# EasyEDA schematic SCH_opl3lpt_2022-04-21.json

## Sheets
1 MAIN: TITLE: Sheet_1; REV: 1.0; Date: 2022-03-24; Sheet: 1/1; Drawn By: Denjhang; Company: Your Company
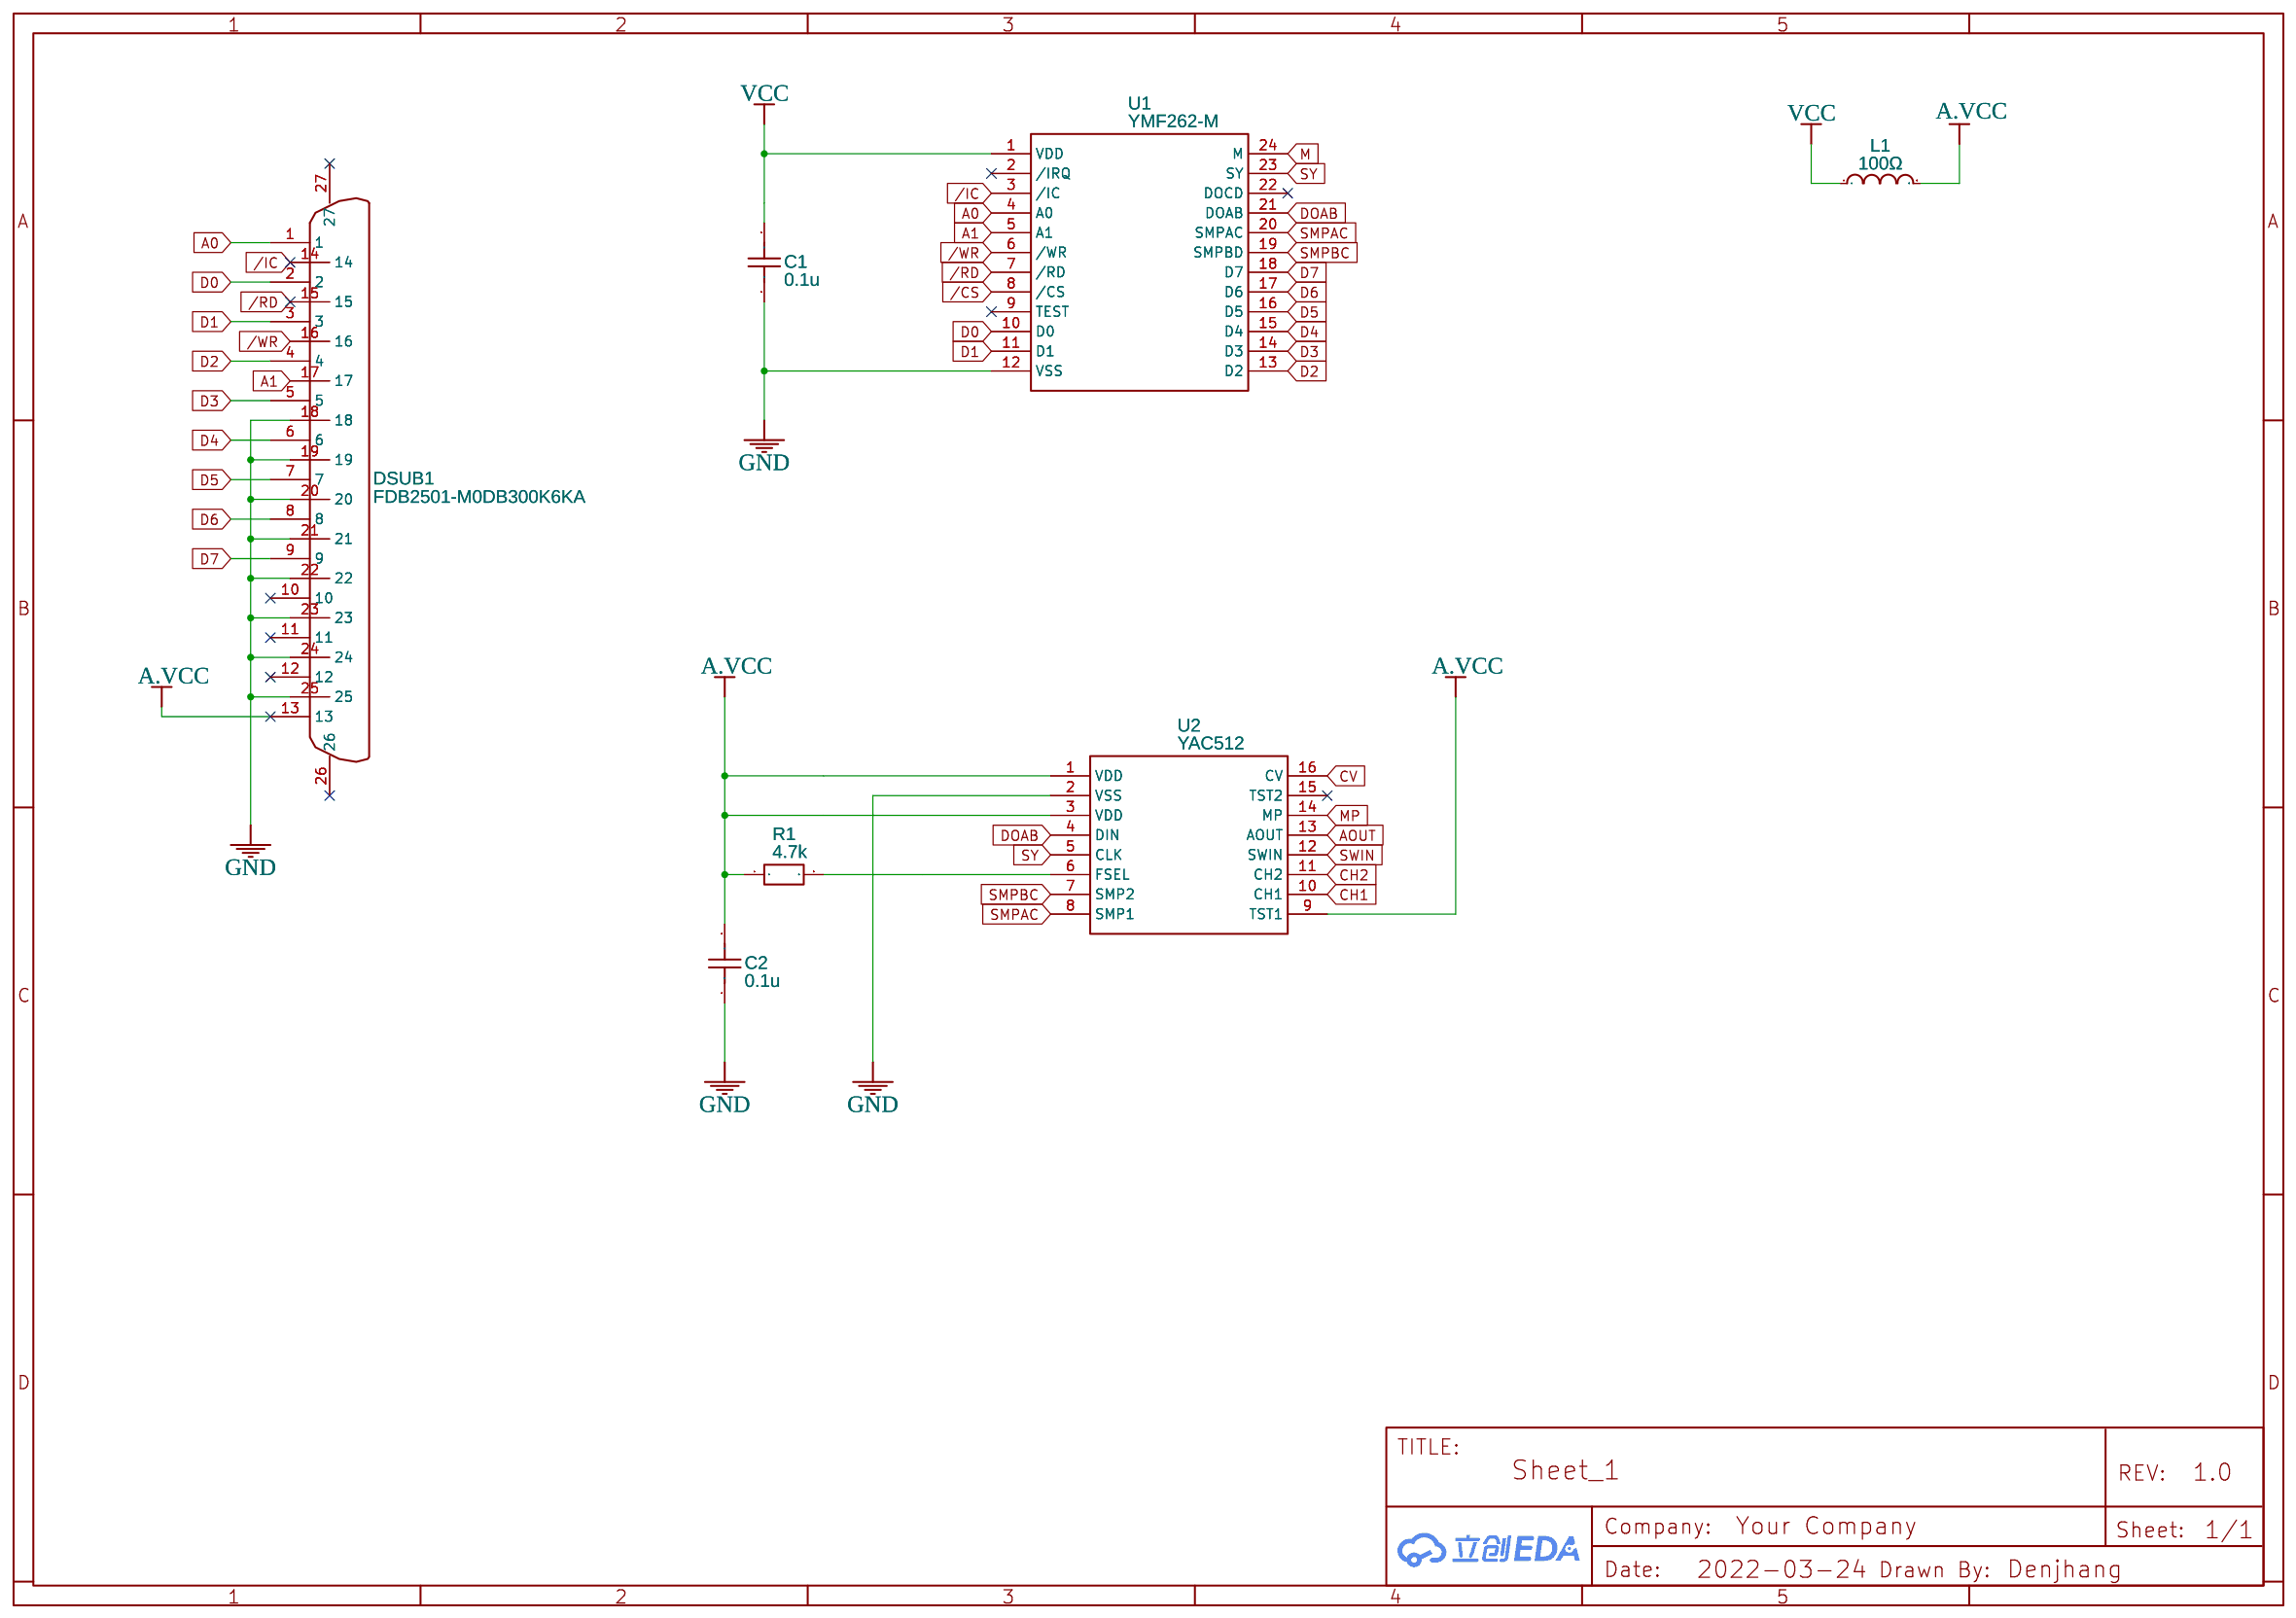
[diagram p0: MAIN]
2 AMP1
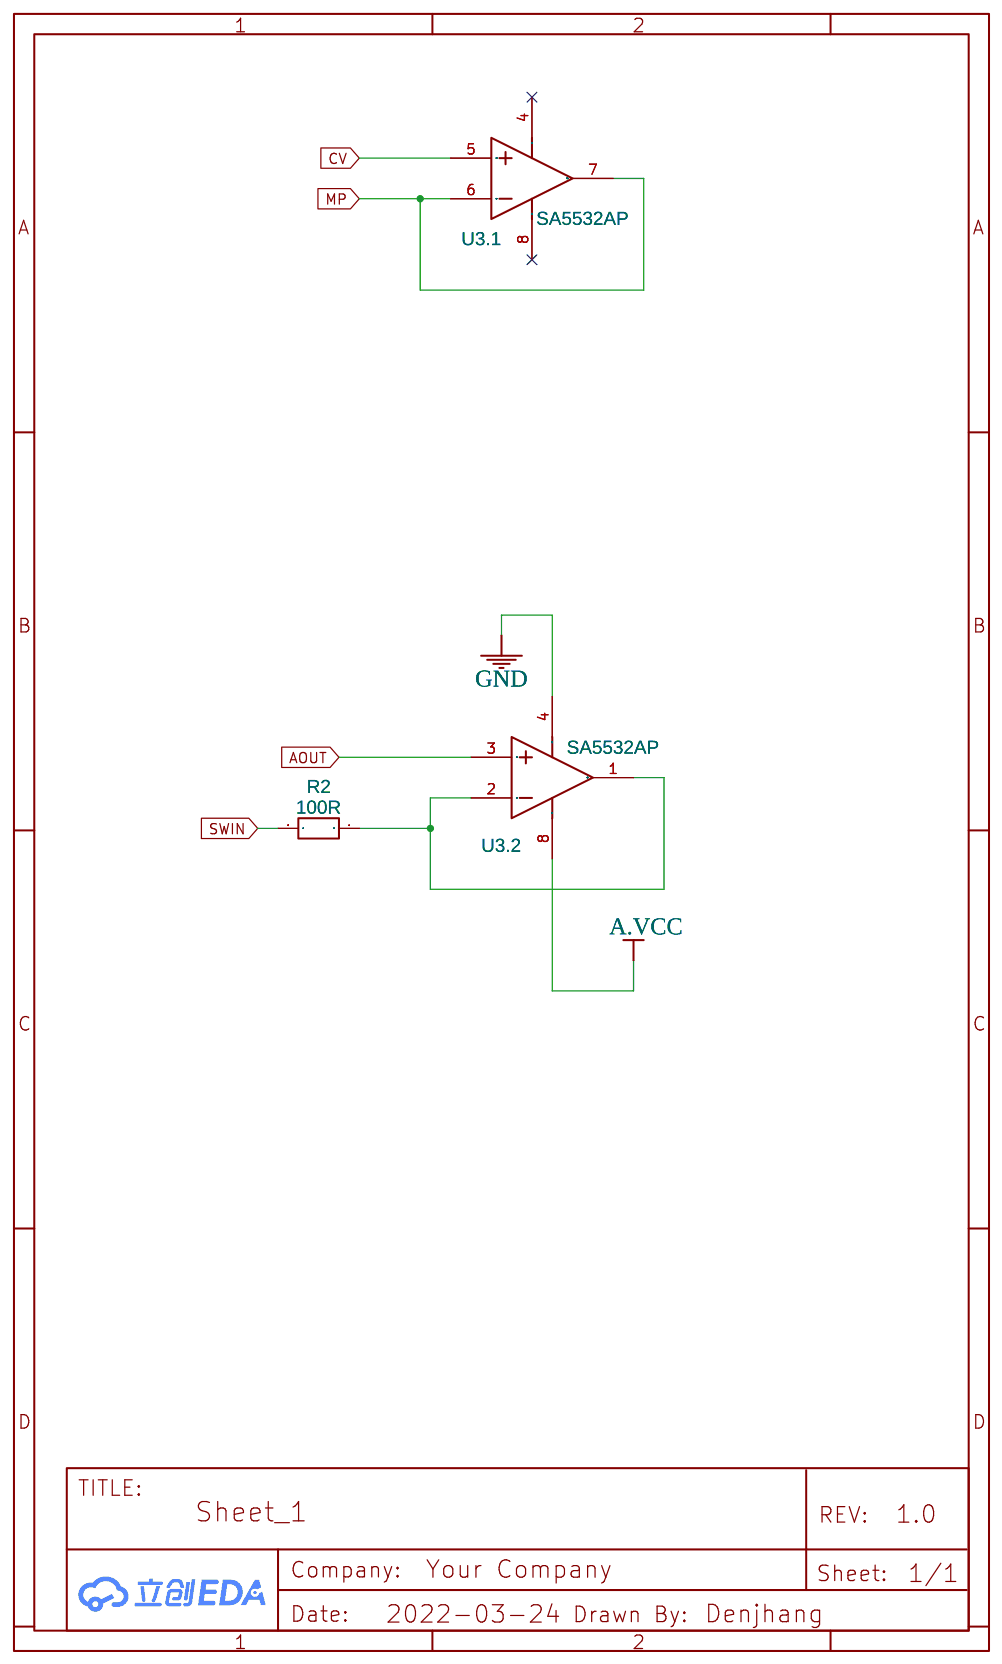
[diagram p1: AMP1]
3 AMP2
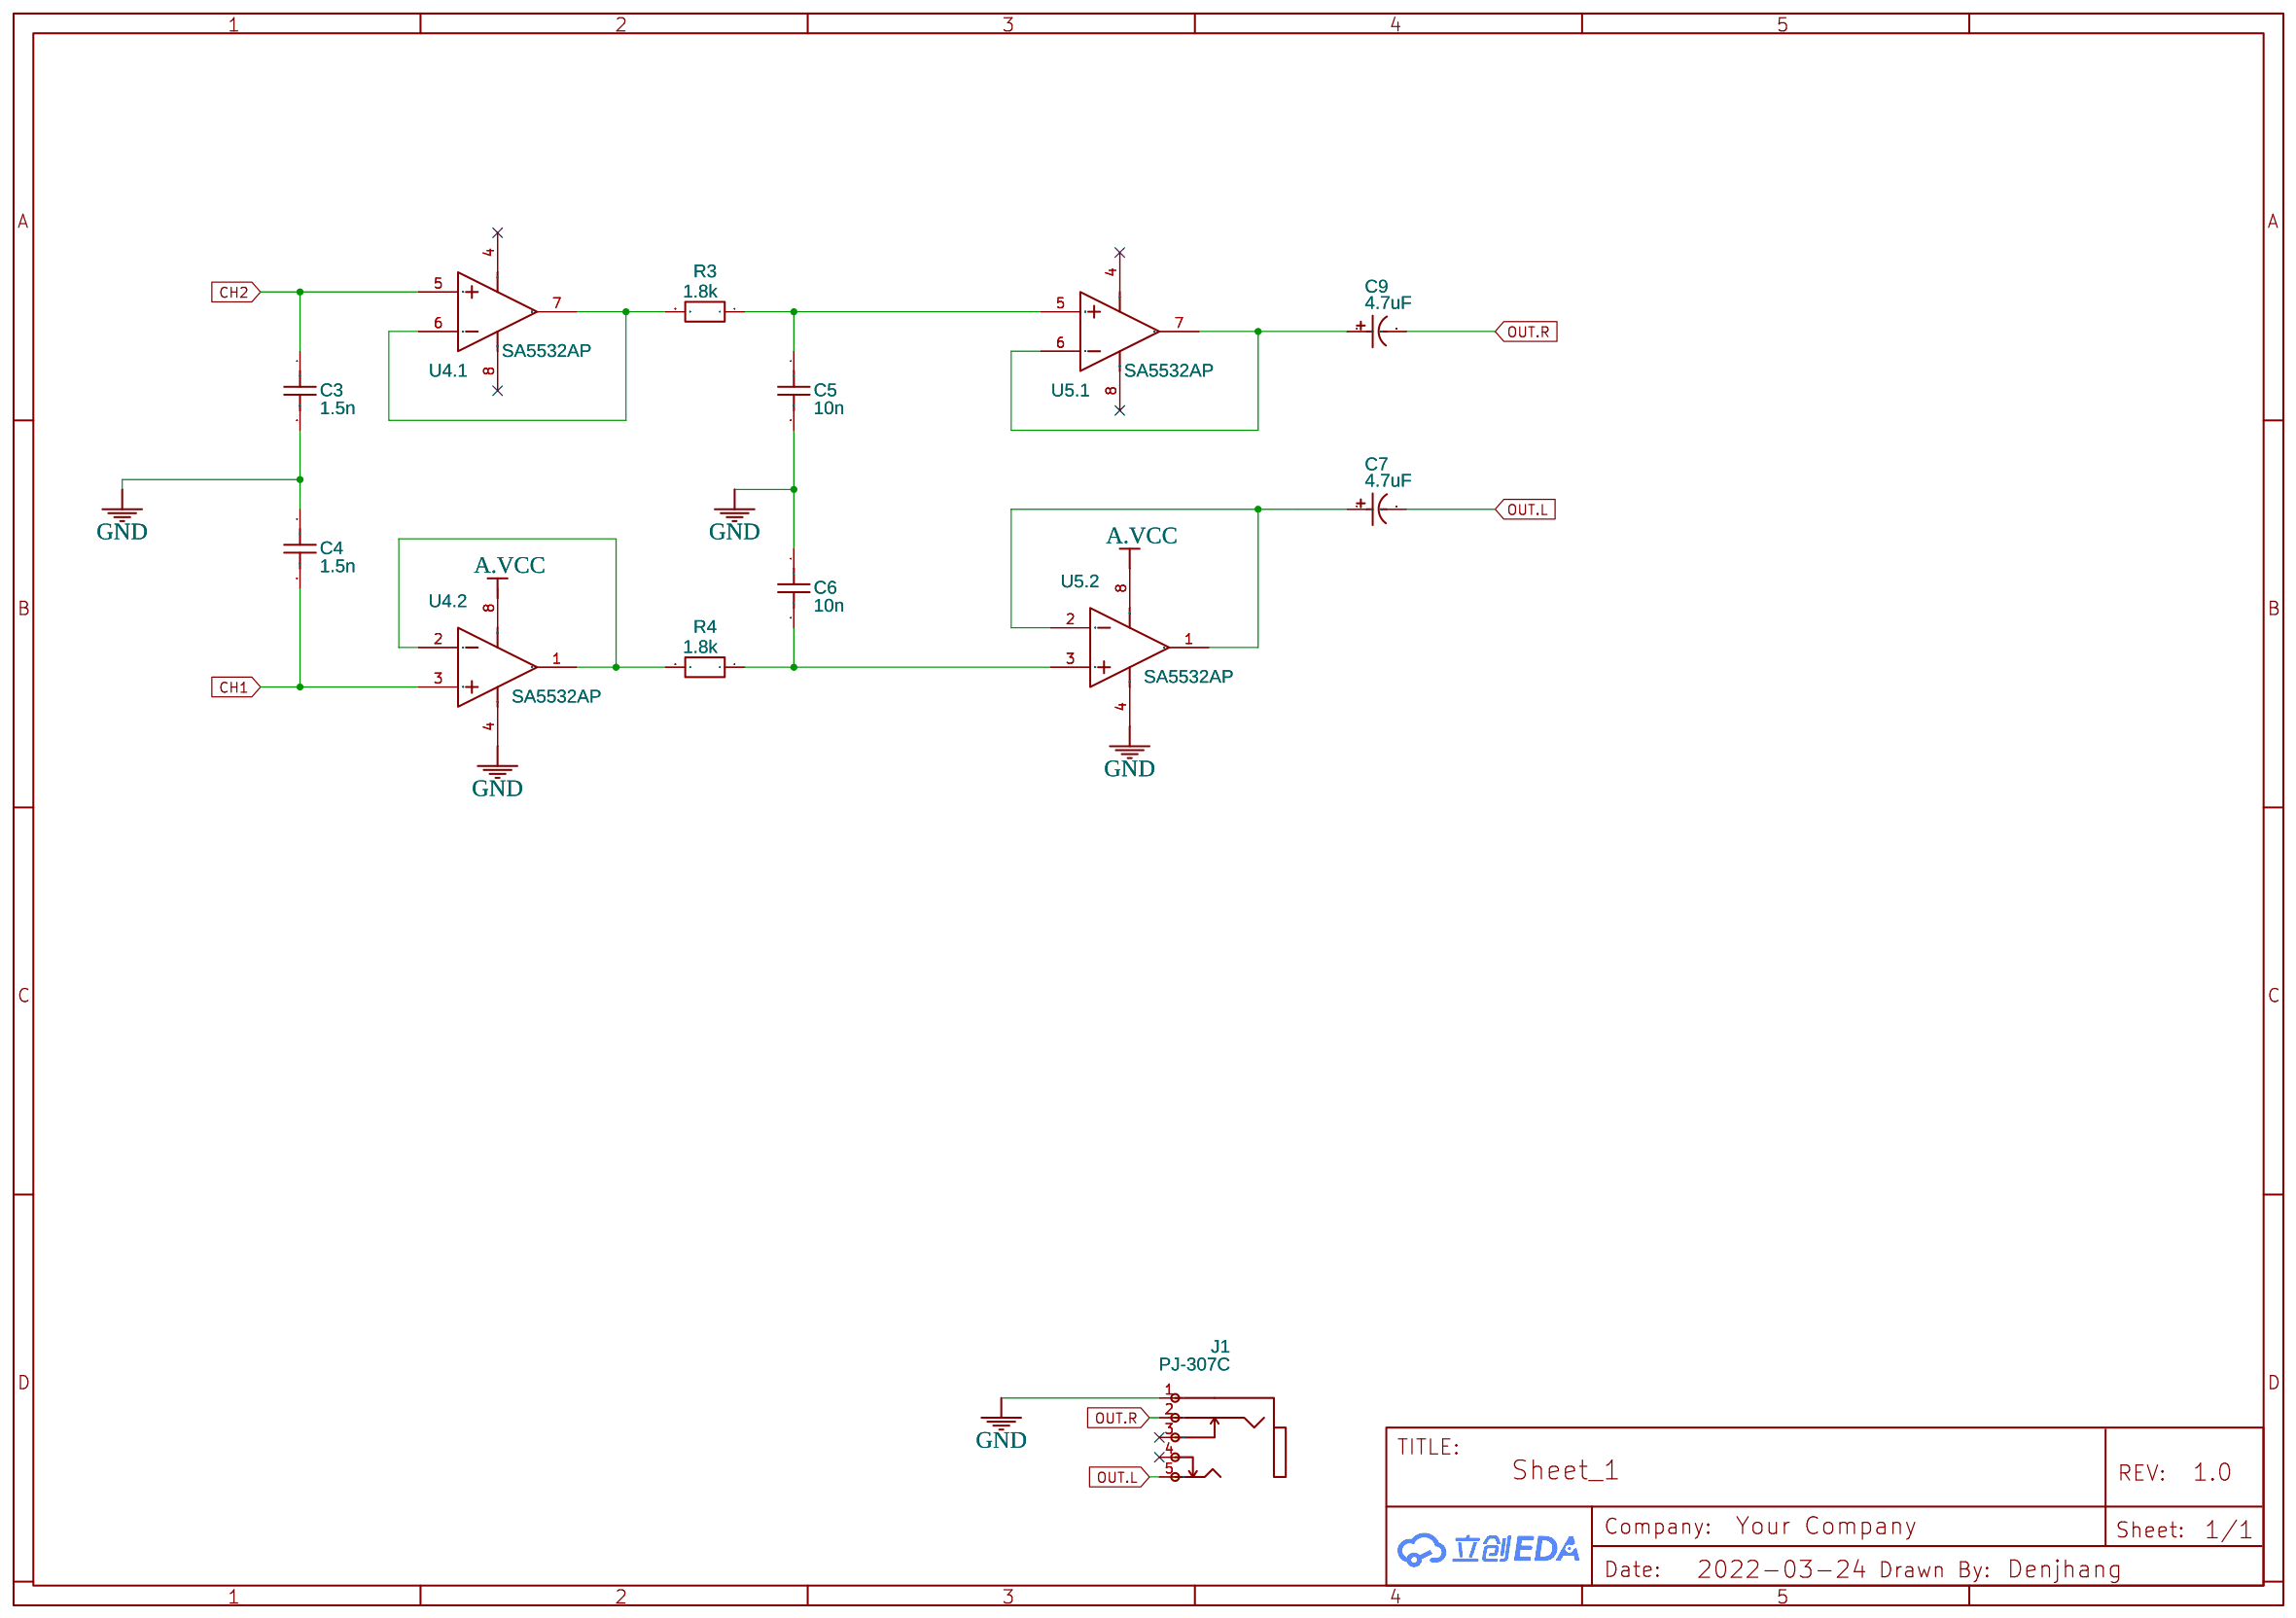
[diagram p2: AMP2]
4 MISC
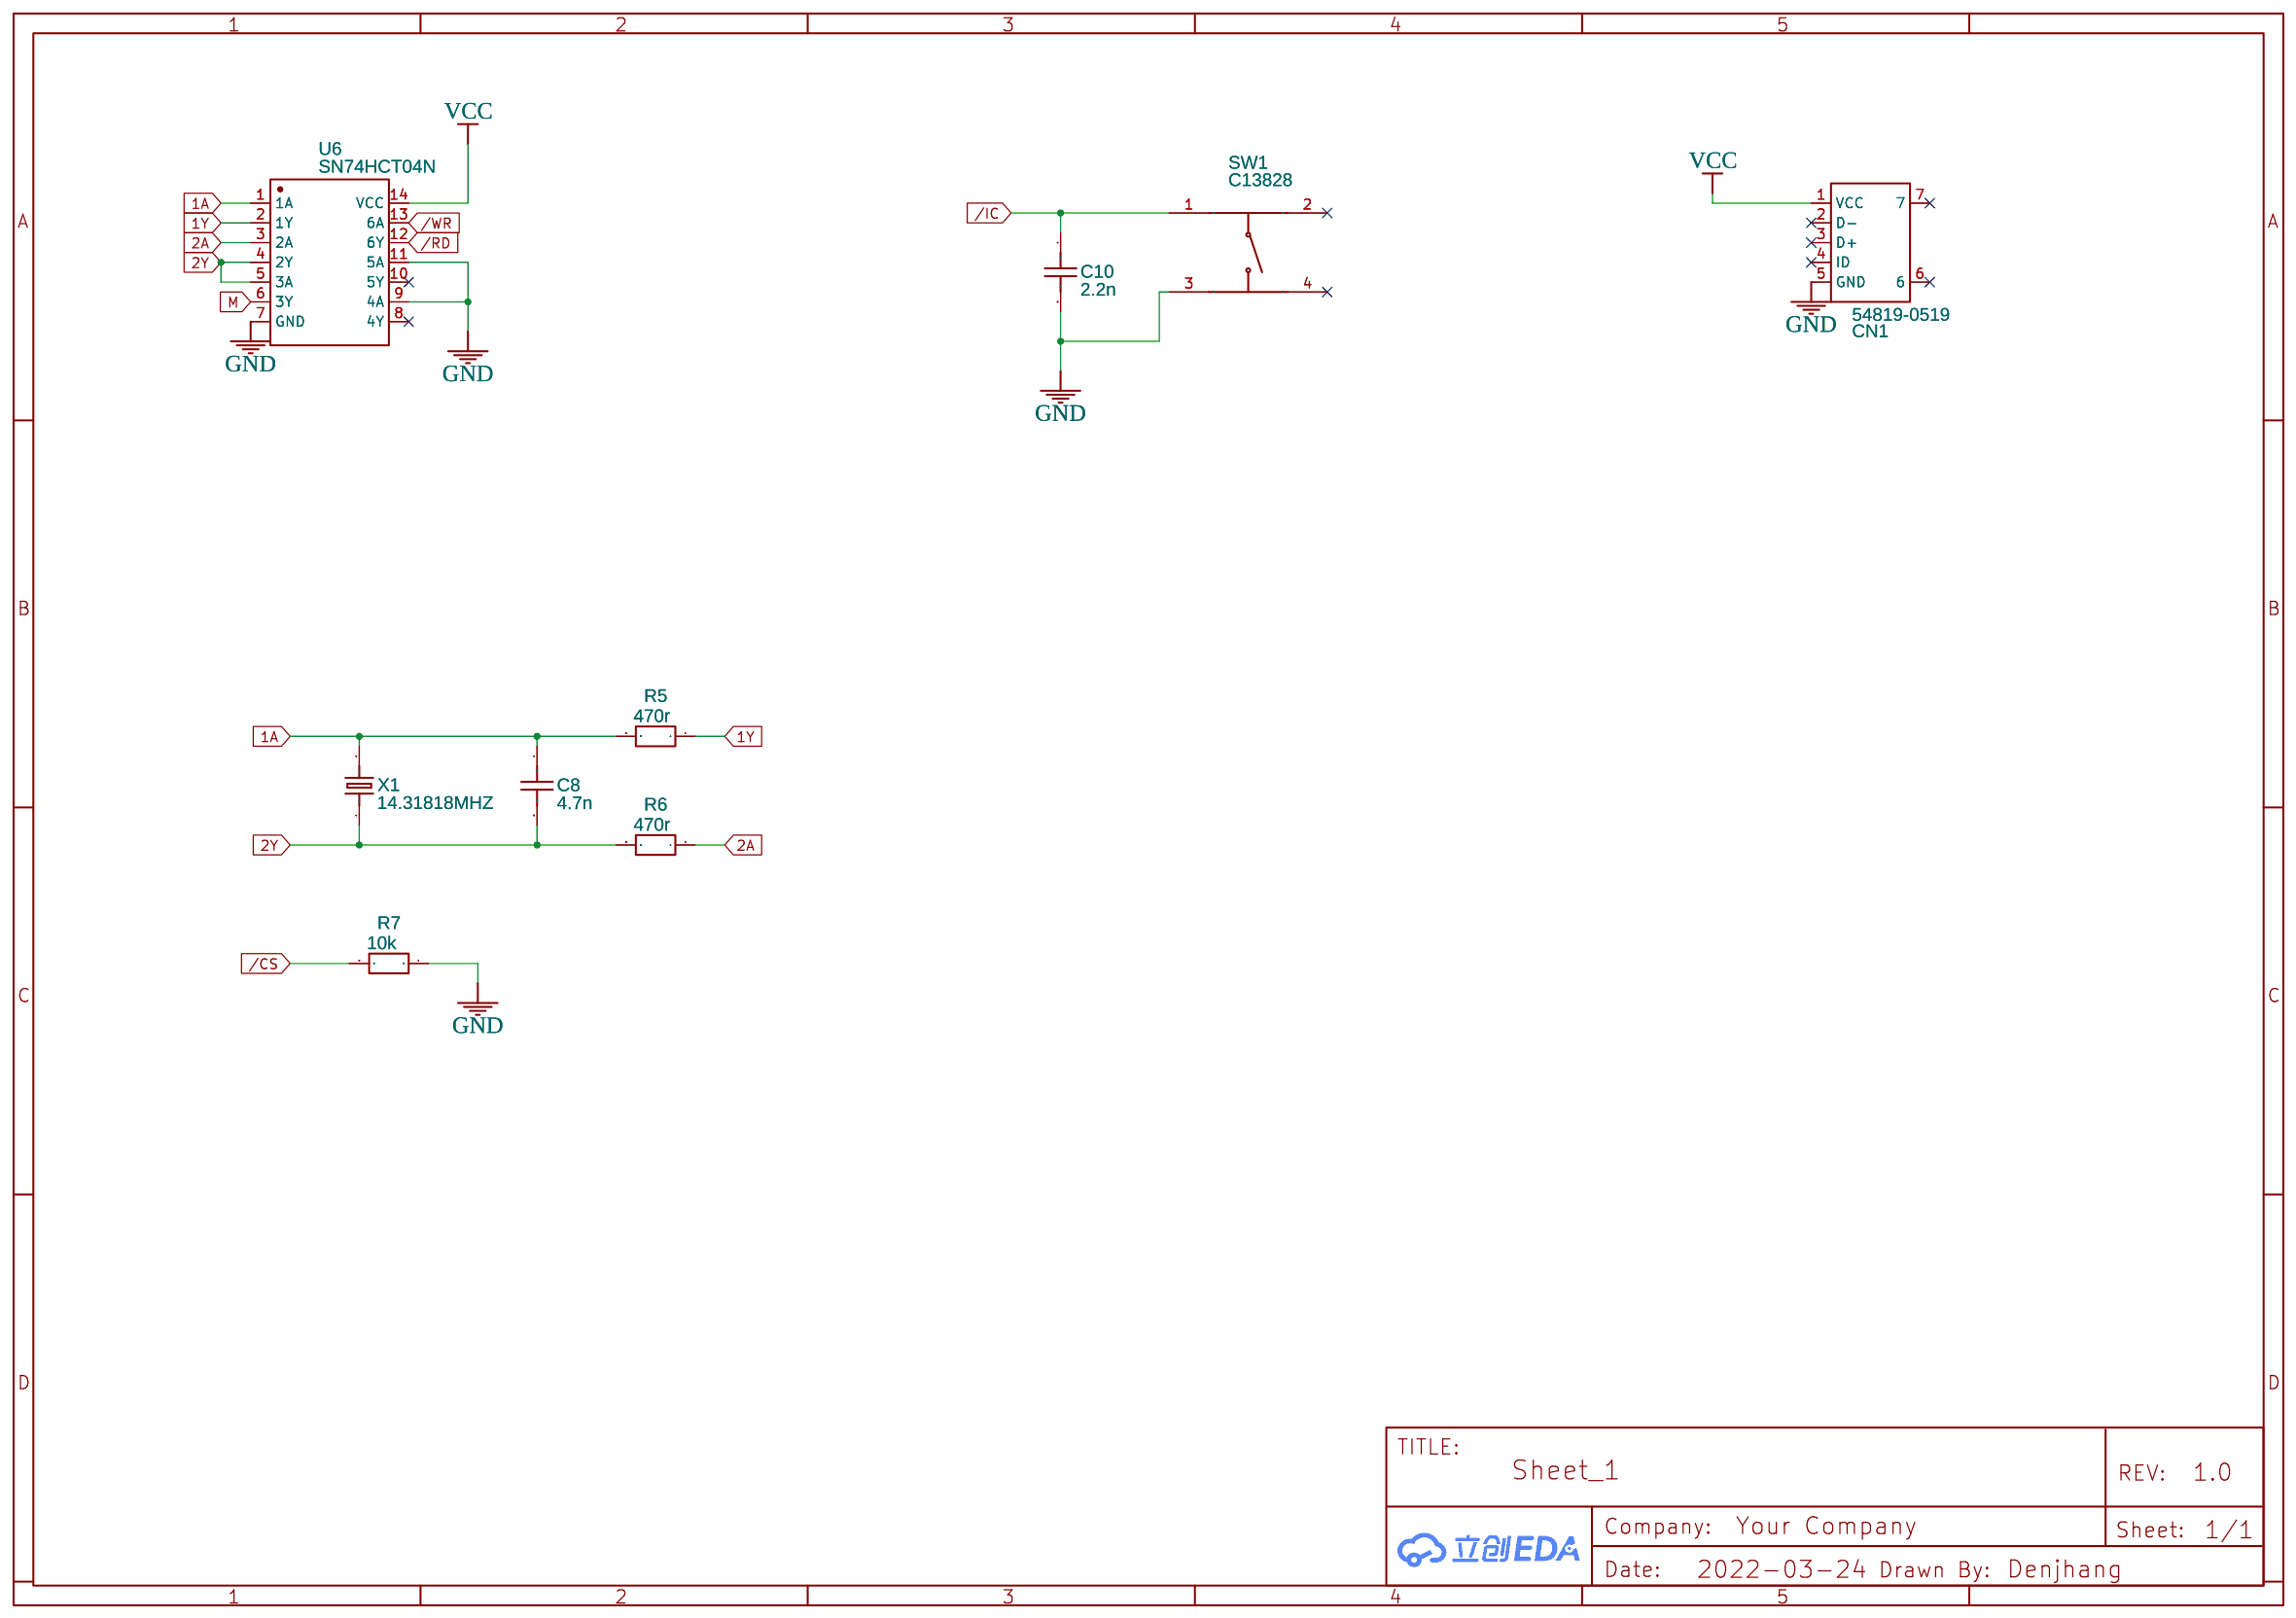
[diagram p3: MISC]

## Parts
sheet AMP1
R2  100R  [R0603]
U3  SA5532AP  [DIP8]  (sections 1,2)
sheet AMP2
C3  1.5n  [C0603]
C4  1.5n  [C0603]
C5  10n  [C0603]
C6  10n  [C0603]
C7  4.7uF  [CAP-TH_BD6.3-P2.50-D1.0-FD]
C9  4.7uF  [CAP-TH_BD6.3-P2.50-D1.0-FD]
J1  PJ-307C  [AUDIO-TH_PJ307C]
R3  1.8k  [R0603]
R4  1.8k  [R0603]
U4  SA5532AP  [DIP8]  (sections 1,2)
U5  SA5532AP  [DIP8]  (sections 1,2)
sheet MAIN
C1  0.1u  [C0603]
C2  0.1u  [C0603]
DSUB1  FDB2501-M0DB300K6KA  [DB25-TH_FDB2501-M0DB300K6KA]
L1  100Ω  [L0603]
R1  4.7k  [R0603]
U1  YMF262-M  [YMF262-M]
U2  YAC512  [SOP-16_L10.3-W5.4-P1.27-LS7.8-BL]
sheet MISC
C8  4.7n  [C0603]
C10  2.2n  [C0603]
CN1  54819-0519  [USB-MINI-SMD_5P-P0.80-H-F_54819-0519]
R5  470r  [R0603]
R6  470r  [R0603]
R7  10k  [R0603]
SW1  C13828  [SW-TH_4P-L6.0-W6.0-P4.50-LS6.5]
U6  SN74HCT04N  [DIP-14_L19.0-W7.0-P2.54-LS7.6-BL]
X1  14.31818MHZ  [HC-49US_L11.5-W4.5-P4.88]

## Library data of the parts
R1-R7 = R_0603_EU: Contributor: LCEDA_Lib
U3-U5 = SA5532AP: Dual Low-Noise Operational Amplifier, 10 to 30 V, -40 to 85 degC, 8-pin DIP (P8), Pb-Free (RoHS); subpart_no: 1
C1-C6 C8 C10 = C_0603_US: Contributor: LCEDA_Lib
C7 C9 = 25V 47uF: Supplier: LCSC; Manufacturer: ValuePro; Manufacturer Part: 电解电容25V 47uF; Supplier Part: C45704; JLCPCB Part Class: Extended Part
J1 = PJ-307C: Supplier: LCSC; Manufacturer: BOOMELE; Supplier Part: C16684; JLCPCB Part Class: Extended Part
DSUB1 = FDB2501-M0DB300K6KA: Supplier: LCSC; Supplier Part: C2834344; Manufacturer: TXGA(特思嘉); Contributor: LCSC
L1 = CBW160808U102T: Supplier: LCSC; Manufacturer: FH; Supplier Part: C50069; JLCPCB Part Class: Extended Part
U1 = YMF262-M: Manufacturer: YAMAHA; Contributor: re1mu
U2 = YAC512: Manufacturer: YAMAHA; Contributor: re1mu
CN1 = 54819-0519: Supplier: LCSC; Supplier Part: C240850; Manufacturer: MOLEX; Contributor: LCSC; JLCPCB Part Class: Extended Part
SW1 = C13828: Supplier: LCSC; Manufacturer: Dongguan Guangzhu Industrial; Contributor: LCSC; JLCPCB Part Class: Extended Part
U6 = SN74HCT04N: Supplier: LCSC; Manufacturer: TI; Contributor: LCSC; Supplier Part: C50939; JLCPCB Part Class: Extended Part
X1 = HC-49/U-S12000000ABJB: Supplier: LCSC; Supplier Part: C326537; Manufacturer: CITIZEN; Contributor: LCSC; JLCPCB Part Class: Extended Part

## Nets
GND: C1.1 C2.1 C3.2 C4.1 C5.2 C6.1 C10.2 CN1.5(GND) DSUB1.18 DSUB1.19 DSUB1.20 DSUB1.21 DSUB1.22 DSUB1.23 DSUB1.24 DSUB1.25 J1.1 R7.1 SW1.3 U1.12(VSS) U2.2(VSS) U3.4(VCC-) U4.4(VCC-) U5.4(VCC-) U6.7(GND) U6.9(4A) U6.11(5A)
VCC: C1.2 CN1.1(VCC) L1.1 U1.1(VDD) U6.14(VCC)
1A: C8.1 R5.2 U6.1(1A) X1.2
1Y: R5.1 U6.2(1Y)
2A: R6.1 U6.3(2A)
2Y: C8.2 R6.2 U6.4(2Y) U6.5(3A) X1.1
/CS: R7.2 U1.8(/CS)
/IC: C10.1 DSUB1.14 SW1.1 U1.3(/IC)
/RD: DSUB1.15 U1.7(/RD) U6.12(6Y)
/WR: DSUB1.16 U1.6(/WR) U6.13(6A)
A0: DSUB1.1 U1.4(A0)
A1: DSUB1.17 U1.5(A1)
A.VCC: C2.2 DSUB1.13 L1.2 R1.1 U2.1(VDD) U2.3(VDD) U2.9(TST1) U3.8(VCC+) U4.8(VCC+) U5.8(VCC+)
AOUT: U2.13(AOUT) U3.3(IN1+)
CH1: C4.2 U2.10(CH1) U4.3(IN1+)
CH2: C3.1 U2.11(CH2) U4.5(IN2+)
CV: U2.16(CV) U3.5(IN2+)
D0: DSUB1.2 U1.10(D0)
D1: DSUB1.3 U1.11(D1)
D2: DSUB1.4 U1.13(D2)
D3: DSUB1.5 U1.14(D3)
D4: DSUB1.6 U1.15(D4)
D5: DSUB1.7 U1.16(D5)
D6: DSUB1.8 U1.17(D6)
D7: DSUB1.9 U1.18(D7)
DOAB: U1.21(DOAB) U2.4(DIN)
M: U1.24(M) U6.6(3Y)
MP: U2.14(MP) U3.6(IN2-) U3.7(OUT2)
OUT.L: C7.2 J1.5
OUT.R: C9.2 J1.2
SMPAC: U1.20(SMPAC) U2.8(SMP1)
SMPBC: U1.19(SMPBD) U2.7(SMP2)
SWIN: R2.2 U2.12(SWIN)
SY: U1.23(SY) U2.5(CLK)
Net-(C5-1): C5.1 R3.1 U5.5(IN2+)
Net-(C6-2): C6.2 R4.1 U5.3(IN1+)
Net-(C7-1): C7.1 U5.1(OUT1) U5.2(IN1-)
Net-(C9-1): C9.1 U5.6(IN2-) U5.7(OUT2)
Net-(R1-2): R1.2 U2.6(FSEL)
Net-(R2-1): R2.1 U3.1(OUT1) U3.2(IN1-)
Net-(R3-2): R3.2 U4.6(IN2-) U4.7(OUT2)
Net-(R4-2): R4.2 U4.1(OUT1) U4.2(IN1-)

Not connected (* = marked no-connect by the designer): CN1 2(D-)* 3(D+)* 4(ID)* 6* 7*; DSUB1 10* 11* 12* 26* 27*; J1 3* 4*; SW1 2* 4*; U1 2(/IRQ)* 9(TEST)* 22(DOCD)*; U2 15(TST2)*; U6 8(4Y)* 10(5Y)*
